# EAGLE design slide_sensor (EAGLE 6.4)
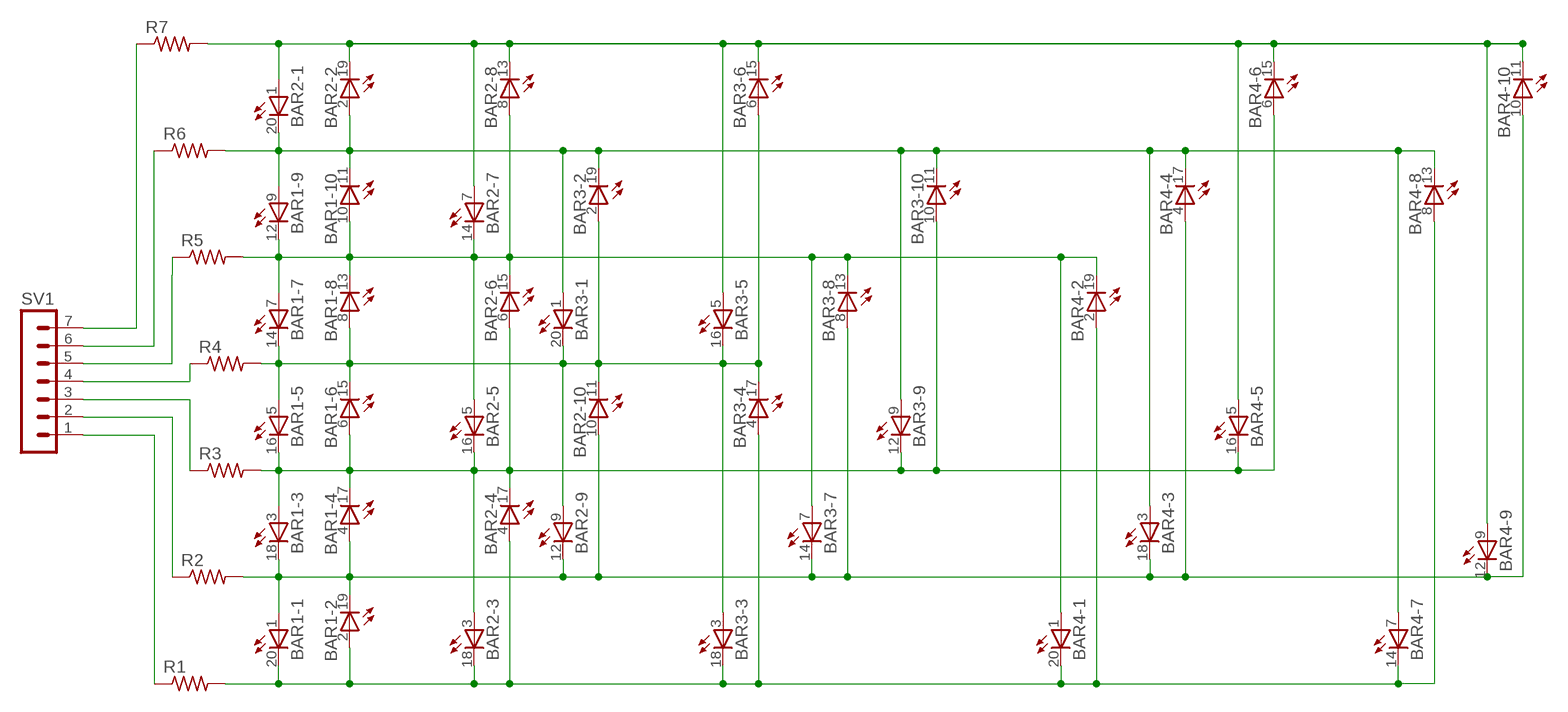
[diagram p0: schematic, sheet 1]

## Parts
BAR1  LB10  [LB10]
BAR2  LB10  [LB10]
BAR3  LB10  [LB10]
BAR4  LB10  [LB10]
R1  R-US_0207/7  [0207/7]
R2  R-US_0207/7  [0207/7]
R3  R-US_0207/7  [0207/7]
R4  R-US_0207/7  [0207/7]
R5  R-US_0207/7  [0207/7]
R6  R-US_0207/7  [0207/7]
R7  R-US_0207/7  [0207/7]
SV1  MA07-1  [MA07-1]

## Nets
N$L1: BAR1.2(-2:A) BAR1.20(-1:C) BAR2.4(-4:A) BAR2.18(-3:C) BAR3.4(-4:A) BAR3.18(-3:C) BAR4.2(-2:A) BAR4.8(-8:A) BAR4.14(-7:C) BAR4.20(-1:C) R1.2
N$L2: BAR1.1(-1:A) BAR1.4(-4:A) BAR1.18(-3:C) BAR1.19(-2:C) BAR2.10(-10:A) BAR2.12(-9:C) BAR3.8(-8:A) BAR3.14(-7:C) BAR4.4(-4:A) BAR4.10(-10:A) BAR4.12(-9:C) BAR4.18(-3:C) R2.2
N$L3: BAR1.3(-3:A) BAR1.6(-6:A) BAR1.16(-5:C) BAR1.17(-4:C) BAR2.3(-3:A) BAR2.6(-6:A) BAR2.16(-5:C) BAR2.17(-4:C) BAR3.10(-10:A) BAR3.12(-9:C) BAR4.6(-6:A) BAR4.16(-5:C) R3.2
N$L4: BAR1.5(-5:A) BAR1.8(-8:A) BAR1.14(-7:C) BAR1.15(-6:C) BAR2.9(-9:A) BAR2.11(-10:C) BAR3.2(-2:A) BAR3.3(-3:A) BAR3.6(-6:A) BAR3.16(-5:C) BAR3.17(-4:C) BAR3.20(-1:C) R4.2
N$L5: BAR1.7(-7:A) BAR1.10(-10:A) BAR1.12(-9:C) BAR1.13(-8:C) BAR2.5(-5:A) BAR2.8(-8:A) BAR2.14(-7:C) BAR2.15(-6:C) BAR3.7(-7:A) BAR3.13(-8:C) BAR4.1(-1:A) BAR4.19(-2:C) R5.2
N$L6: BAR1.9(-9:A) BAR1.11(-10:C) BAR2.2(-2:A) BAR2.20(-1:C) BAR3.1(-1:A) BAR3.9(-9:A) BAR3.11(-10:C) BAR3.19(-2:C) BAR4.3(-3:A) BAR4.7(-7:A) BAR4.13(-8:C) BAR4.17(-4:C) R6.2
N$L7: BAR2.1(-1:A) BAR2.7(-7:A) BAR2.13(-8:C) BAR2.19(-2:C) BAR3.5(-5:A) BAR3.15(-6:C) BAR4.5(-5:A) BAR4.9(-9:A) BAR4.11(-10:C) BAR4.15(-6:C) R7.2
N$P1: R1.1 SV1.1
N$P2: R2.1 SV1.2
N$P3: R3.1 SV1.3
N$P4: R4.1 SV1.4
N$P5: R5.1 SV1.5
N$P6: R6.1 SV1.6
N$P7: R7.1 SV1.7

## Library data of the parts
BAR1-BAR4 = led:LB10: LED BLOCK 10-LED bar graph, DIL, Siemens
R1-R7 = rcl:R-US_: RESISTOR, American symbol
SV1 = con-lstb:MA07-1: PIN HEADER; OC_FARNELL: unknown; OC_NEWARK: unknown

## Board
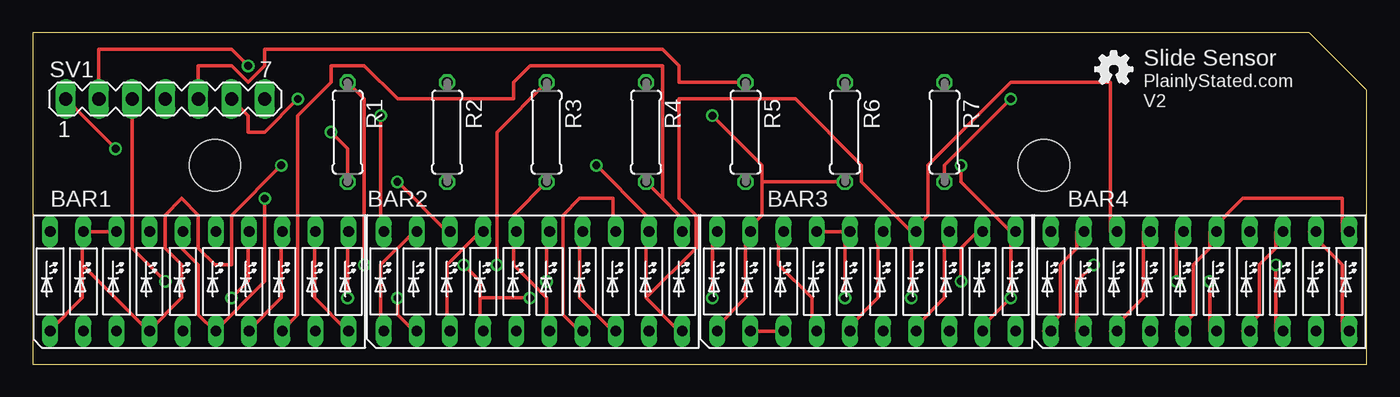
[diagram p1: board, top side]
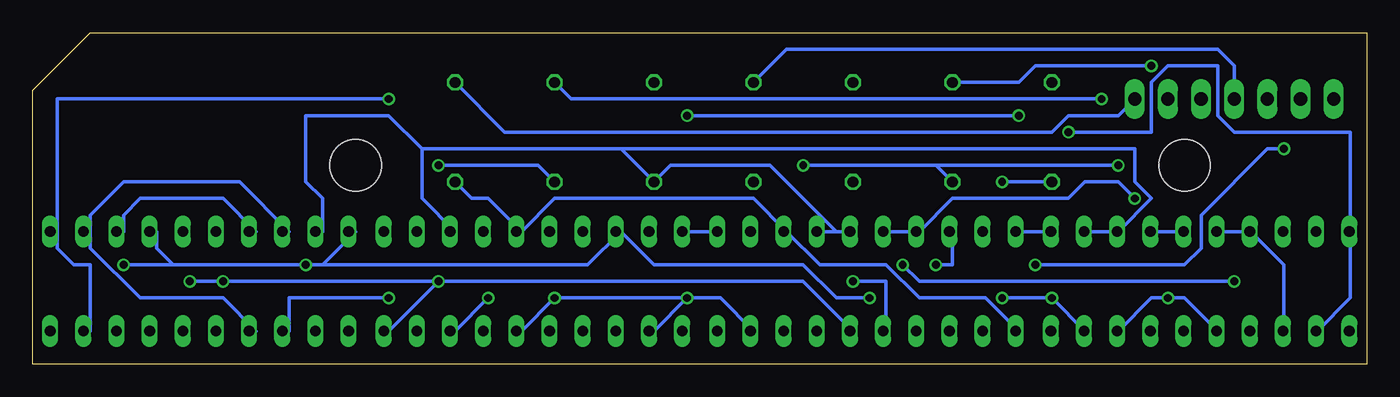
[diagram p2: board, bottom side, seen from below]

Size 102.21 x 25.4 mm. Coordinates in mm from the lower left corner, seen from the top.
Outline: 0,0 102.21,0 102.21,19.04 102.21,20.98 97.79,25.4 0,25.4 0,0
Copper layers (1*16): Top 0.0356mm / dielectric 1.5011mm / Bottom 0.0356mm
Design rules "LaenPCBOrder": minimum track width 6mil, minimum drill 13mil, track to track 6mil, track to pad 6mil, pad to pad 6mil, via to via 6mil, smd to smd 6mil, copper to edge 15mil, drill to drill 6mil, minimum pad ring 7mil, minimum via ring 7mil, stop-mask expansion 4mil, vias tented up to drill 0mil, thermal gap 10mil
Holes 3.94 mm at 13.97,15.24 77.47,15.24

### Footprints (pad centres in the part's own frame; a part is rotated, then mirrored left to right if it is on the bottom)
LB10 = drill 0.813 long: 1 -11.43,-3.81; 2 -8.89,-3.81; 3 -6.35,-3.81; 4 -3.81,-3.81; 5 -1.27,-3.81; 6 1.27,-3.81; 7 3.81,-3.81; 8 6.35,-3.81; 9 8.89,-3.81; 10 11.43,-3.81; 11 11.43,3.81; 12 8.89,3.81; 13 6.35,3.81; 14 3.81,3.81; 15 1.27,3.81; 16 -1.27,3.81; 17 -3.81,3.81; 18 -6.35,3.81; 19 -8.89,3.81; 20 -11.43,3.81
0207/7 = drill 0.813 octagon: 1 -3.81,0; 2 3.81,0
MA07-1 = drill 1.016 long: 1 -7.62,0; 2 -5.08,0; 3 -2.54,0; 4 0,0; 5 2.54,0; 6 5.08,0; 7 7.62,0

### Placement (x,y rotation side)
BAR1  12.78,6.35 0 top
BAR2  38.33,6.35 0 top
BAR3  63.88,6.35 0 top
BAR4  89.43,6.35 0 top
R1  24.13,17.78 270 top
R2  31.75,17.78 270 top
R3  39.37,17.78 270 top
R4  46.99,17.78 270 top
R5  54.61,17.78 270 top
R6  62.23,17.78 270 top
R7  69.85,17.78 270 top
SV1  10.16,20.32 0 top
U$1  [OSHW_FILLX100_NOTEXT]  81.41,21.46 0 top

### Tracks (layer width: path | path; a pad name or v marks a point on that pad's centre or on a via)
N$L1  (via drill 0.61)
  Top 0.254: BAR3.18 57.15,10.16 57.15,7.62 59.69,5.08 59.69,2.54 BAR3.4 | v81.28,7.62 80.01,6.35 80.01,2.54 BAR4.2 | v95.25,7.62 95.25,2.54 BAR4.8 | v33.02,7.62 34.29,6.35 34.29,5.08 | 34.29,5.08 34.29,2.54 BAR2.4 | v27.94,13.97 31.75,10.16 BAR2.18 | v22.86,17.78 24.13,16.51 R1.2 | 34.29,5.08 v38.1,5.08
  Bottom 0.254: 80.01,7.62 77.47,10.16 BAR4.20 | 91.44,7.62 v81.28,7.62 80.01,7.62 | 91.44,7.62 92.71,8.89 92.71,10.16 BAR4.14 | 91.44,7.62 v95.25,7.62 | 57.15,10.16 59.69,7.62 80.01,7.62 | 57.15,10.16 BAR3.18 57.15,10.16 | 1.27,10.16 1.27,5.08 3.81,2.54 BAR1.2 | 1.27,10.16 BAR1.20 1.27,10.16 | v33.02,7.62 31.75,7.62 31.75,10.16 BAR2.18 | v27.94,13.97 R1.2 | 1.27,10.16 1.27,17.78 10.16,17.78 11.43,19.05 11.43,22.86 15.24,22.86 16.51,21.59 16.51,17.78 v22.86,17.78 | 57.15,10.16 54.61,7.62 43.18,7.62 40.64,5.08 v38.1,5.08
N$L2  (via drill 0.61)
  Top 0.254: 67.31,10.16 v67.31,5.08 | 67.31,10.16 BAR3.14 | BAR4.10 100.33,2.54 100.33,7.62 97.79,10.16 BAR4.12 | 67.31,10.16 68.58,11.43 68.58,15.24 74.93,21.59 82.55,21.59 82.55,10.16 BAR4.18 | 67.31,10.16 BAR3.14 | 3.81,10.16 3.81,7.62 | 3.81,7.62 3.81,5.08 1.27,2.54 BAR1.1 | 3.81,10.16 BAR1.19 | 3.81,10.16 BAR1.19 | BAR1.19 6.35,10.16 BAR1.18 | 3.81,10.16 BAR1.19 | 3.81,7.62 8.89,2.54 | 8.89,2.54 BAR1.4 8.89,2.54 | v43.18,15.24 46.99,11.43 46.99,10.16 | 46.99,10.16 BAR2.12 46.99,10.16 | 46.99,5.08 49.53,2.54 BAR2.10 | 46.99,10.16 46.99,5.08 | 8.89,2.54 11.43,5.08 11.43,7.62 10.16,8.89 10.16,11.43 11.43,12.7 12.7,11.43 12.7,8.89 13.97,7.62 15.24,7.62 15.24,11.43 v19.05,15.24 | 67.31,10.16 63.5,13.97 63.5,15.24 58.42,20.32 49.53,20.32 49.53,12.7 50.8,11.43 50.8,8.89 46.99,5.08 | 67.31,10.16 BAR3.14
  Bottom 0.254: v67.31,5.08 69.85,2.54 BAR3.8 | 97.79,10.16 97.79,8.89 93.98,5.08 87.63,5.08 85.09,2.54 BAR4.4 | 97.79,10.16 BAR4.12 97.79,10.16 | 97.79,10.16 97.79,11.43 95.25,13.97 86.36,13.97 82.55,10.16 BAR4.18 | 33.02,15.24 R2.2 | v43.18,15.24 33.02,15.24 | 33.02,15.24 v19.05,15.24
N$L3  (via drill 0.61)
  Top 0.254: 13.97,2.54 12.7,3.81 12.7,7.62 11.43,8.89 11.43,10.16 BAR1.16 | 13.97,2.54 BAR1.6 13.97,2.54 | BAR2.3 31.75,2.54 31.75,7.62 34.29,10.16 BAR2.17 | 36.83,10.16 36.83,7.62 39.37,5.08 39.37,2.54 BAR2.6 | 36.83,10.16 BAR2.16 36.83,10.16 | R3.2 36.83,11.43 36.83,10.16 | v71.12,6.35 71.12,8.89 72.39,10.16 BAR3.12 | v87.63,6.35 87.63,10.16 BAR4.16 | v90.17,6.35 90.17,2.54 BAR4.6 | 13.97,2.54 17.78,6.35 v17.78,12.7
  Bottom 0.254: 8.89,10.16 6.35,7.62 6.35,2.54 BAR1.3 | 8.89,10.16 BAR1.17 | BAR1.17 11.43,10.16 BAR1.16 | BAR1.17 8.89,10.16 | 8.89,10.16 BAR1.17 | v71.12,6.35 74.93,2.54 BAR3.10 | v71.12,6.35 43.18,6.35 39.37,2.54 BAR2.6 | v71.12,6.35 v87.63,6.35 v90.17,6.35 | BAR2.17 36.83,10.16 BAR2.16 | BAR2.17 34.29,10.16 | 34.29,10.16 BAR2.17 | v17.78,12.7 19.05,13.97 21.59,13.97 22.86,12.7 31.75,12.7 34.29,10.16 | 34.29,10.16 BAR2.17
N$L4  (via drill 0.61)
  Top 0.254: v15.24,5.08 16.51,6.35 16.51,10.16 BAR1.14 | 48.26,12.7 49.53,11.43 49.53,10.16 BAR2.11 | 48.26,12.7 R4.2 | 62.23,10.16 BAR3.17 | BAR3.17 59.69,10.16 BAR3.17 | 62.23,10.16 BAR3.16 62.23,10.16 | BAR3.2 54.61,2.54 BAR3.2 | BAR3.2 57.15,2.54 BAR3.3 | v62.23,5.08 62.23,10.16 | v52.07,5.08 52.07,10.16 BAR3.20 | 48.26,12.7 48.26,22.86 38.1,22.86 36.83,21.59 36.83,20.32 27.94,20.32 25.4,22.86 22.86,22.86 22.86,21.59 20.32,19.05 20.32,3.81 19.05,2.54 BAR1.8
  Bottom 0.254: BAR1.15 16.51,10.16 BAR1.14 | BAR1.15 13.97,10.16 BAR1.15 | BAR1.5 11.43,2.54 13.97,5.08 v15.24,5.08 16.51,5.08 19.05,2.54 BAR1.8 | BAR2.11 52.07,10.16 BAR3.20 | BAR2.11 49.53,10.16 BAR2.11 | v52.07,5.08 49.53,5.08 46.99,2.54 BAR2.9 | v52.07,5.08 54.61,2.54 BAR3.2 | v52.07,5.08 v62.23,5.08 64.77,2.54 BAR3.6
N$L5  (via drill 0.61)
  Top 0.254: BAR1.7 16.51,2.54 19.05,5.08 19.05,10.16 BAR1.13 | BAR1.10 24.13,2.54 21.59,5.08 21.59,10.16 BAR1.12 | BAR4.1 77.47,2.54 78.74,3.81 78.74,7.62 80.01,8.89 80.01,10.16 BAR4.19 | BAR3.7 67.31,2.54 69.85,5.08 69.85,10.16 BAR3.13 | v39.37,6.35 39.37,10.16 BAR2.15 | BAR2.8 44.45,2.54 41.91,5.08 41.91,10.16 BAR2.14
  Bottom 0.254: BAR1.13 21.59,10.16 BAR1.12 | BAR1.13 19.05,10.16 | 19.05,10.16 BAR1.13 | v39.37,6.35 36.83,6.35 36.83,2.54 BAR2.5 | BAR2.15 39.37,10.16 BAR2.15 | BAR2.15 40.64,10.16 | 40.64,10.16 41.91,10.16 BAR2.14 | 40.64,10.16 45.72,15.24 53.34,15.24 R5.2 57.15,16.51 | 72.39,16.51 72.39,12.7 69.85,10.16 BAR3.13 | 57.15,16.51 72.39,16.51 | 72.39,16.51 74.93,19.05 81.28,19.05 81.28,13.97 80.01,12.7 80.01,10.16 BAR4.19 | 19.05,10.16 16.51,12.7 17.78,13.97 17.78,16.51 57.15,16.51 | 19.05,10.16 BAR1.13
N$L6  (via drill 0.61)
  Top 0.254: BAR4.3 82.55,2.54 85.09,5.08 85.09,10.16 BAR4.17 | BAR4.7 92.71,2.54 93.98,3.81 93.98,7.62 95.25,8.89 95.25,10.16 BAR4.13 | v24.13,5.08 24.13,10.16 BAR1.11 | v27.94,5.08 27.94,3.81 29.21,2.54 BAR2.2 | 74.93,10.16 v74.93,5.08 72.39,2.54 BAR3.9 | 74.93,10.16 BAR3.11 74.93,10.16 | 54.61,10.16 54.61,5.08 52.07,2.54 BAR3.1 | 54.61,10.16 BAR3.19 54.61,10.16 | 55.88,13.97 R6.2 | 55.88,13.97 55.88,11.43 54.61,10.16 | 74.93,10.16 71.12,13.97 v71.12,15.24 | v26.67,19.05 26.67,10.16 BAR2.20 | v52.07,19.05 55.88,15.24 55.88,13.97
  Bottom 0.254: BAR4.17 85.09,10.16 87.63,12.7 93.98,12.7 95.25,11.43 95.25,10.16 BAR4.13 | BAR1.9 21.59,2.54 v24.13,5.08 v27.94,5.08 | BAR1.11 24.13,10.16 BAR1.11 | BAR1.11 26.67,10.16 BAR2.20 | v71.12,15.24 63.5,15.24 R6.2 | v52.07,19.05 v26.67,19.05 | v74.93,5.08 82.55,5.08 82.55,2.54 BAR4.3
N$L7  (via drill 0.61)
  Top 0.254: 90.17,10.16 90.17,8.89 88.9,7.62 88.9,3.81 87.63,2.54 BAR4.5 | 90.17,10.16 BAR4.15 90.17,10.16 | 90.17,10.16 92.71,12.7 100.33,12.7 100.33,10.16 BAR4.11 | BAR3.5 62.23,2.54 64.77,5.08 64.77,10.16 BAR3.15 | BAR2.1 26.67,2.54 26.67,7.62 29.21,10.16 BAR2.19 | BAR2.7 41.91,2.54 40.64,3.81 40.64,11.43 41.91,12.7 44.45,12.7 44.45,10.16 BAR2.13 | v74.93,20.32 69.85,15.24 R7.2
  Bottom 0.254: 100.33,10.16 100.33,8.89 99.06,7.62 97.79,7.62 97.79,2.54 BAR4.9 | 100.33,10.16 BAR4.11 100.33,10.16 | R7.2 68.58,12.7 67.31,12.7 64.77,10.16 | 64.77,10.16 BAR3.15 64.77,10.16 | 44.45,10.16 41.91,7.62 36.83,7.62 34.29,5.08 29.21,5.08 26.67,2.54 BAR2.1 | 44.45,10.16 BAR2.13 44.45,10.16 | 64.77,10.16 62.23,12.7 46.99,12.7 44.45,10.16 | 100.33,10.16 100.33,20.32 v74.93,20.32
N$P1  (via drill 0.61)
  Top 0.254: R1.1 25.4,20.32 v25.4,7.62 | SV1.1 v6.35,16.51
  Bottom 0.254: v25.4,7.62 13.97,7.62 12.7,8.89 12.7,11.43 7.62,16.51 v6.35,16.51
N$P2  (via drill 0.61)
  Top 0.254: v16.51,22.86 15.24,24.13 5.08,24.13 SV1.2
  Bottom 0.254: R2.1 26.67,21.59 25.4,22.86 v16.51,22.86
N$P3  (via drill 0.61)
  Top 0.254: R3.1 35.56,17.78 v35.56,7.62 | v10.16,6.35 7.62,8.89 SV1.3
  Bottom 0.254: v35.56,7.62 34.29,6.35 v10.16,6.35
N$P4
  Bottom 0.254: R4.1 44.45,24.13 11.43,24.13 10.16,22.86 SV1.4
N$P5
  Top 0.254: R5.1 49.53,21.59 49.53,22.86 48.26,24.13 17.78,24.13 17.78,22.86 16.51,21.59 15.24,22.86 12.7,22.86 SV1.5
N$P6  (via drill 0.61)
  Top 0.254: v20.32,20.32 17.78,17.78 16.51,17.78 16.51,19.05 SV1.6
  Bottom 0.254: R6.1 60.96,20.32 v20.32,20.32
N$P7
  Bottom 0.254: R7.1 66.04,17.78 24.13,17.78 22.86,19.05 19.05,19.05 SV1.7

### Text on the board
_tsilk: Slide Sensor | PlainlyStated.com / V2